# EAGLE design retainer (EAGLE 9.0.1)
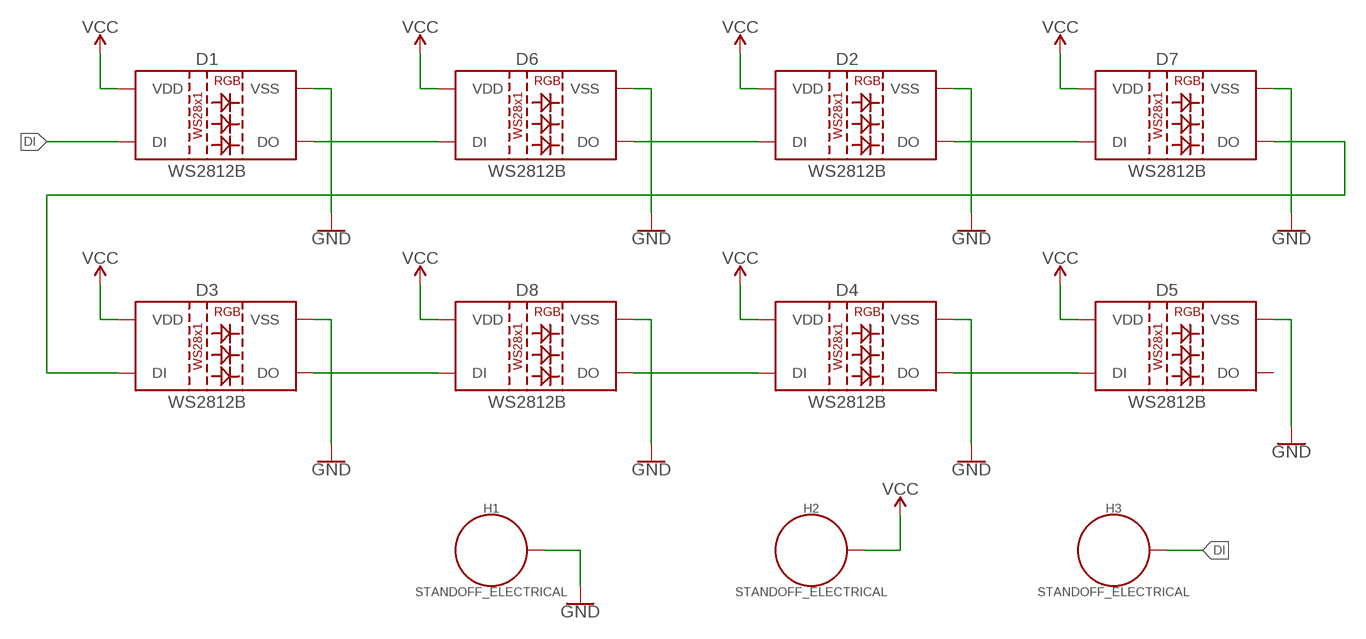
[diagram p0: schematic, sheet 1]

## Parts
D1  WS2812B  [WS2812B]
D2  WS2812B  [WS2812B]
D3  WS2812B  [WS2812B]
D4  WS2812B  [WS2812B]
D5  WS2812B  [WS2812B]
D6  WS2812B  [WS2812B]
D7  WS2812B  [WS2812B]
D8  WS2812B  [WS2812B]
H1  STANDOFF_ELECTRICAL  [STANDOFF-ELECTRICAL]
H2  STANDOFF_ELECTRICAL  [STANDOFF-ELECTRICAL]
H3  STANDOFF_ELECTRICAL  [STANDOFF-ELECTRICAL]

## Nets
DI: D1.4(DI) H3.P1
GND: D1.3(VSS) D2.3(VSS) D3.3(VSS) D4.3(VSS) D5.3(VSS) D6.3(VSS) D7.3(VSS) D8.3(VSS) H1.P1
N$3: D1.2(DO) D6.4(DI)
N$4: D2.4(DI) D6.2(DO)
N$5: D2.2(DO) D7.4(DI)
N$6: D3.4(DI) D7.2(DO)
N$7: D3.2(DO) D8.4(DI)
N$8: D4.4(DI) D8.2(DO)
N$9: D4.2(DO) D5.4(DI)
VCC: D1.1(VDD) D2.1(VDD) D3.1(VDD) D4.1(VDD) D5.1(VDD) D6.1(VDD) D7.1(VDD) D8.1(VDD) H2.P1
Unconnected: D5.2(DO)

## Library data of the parts
D1-D8 = SparkFun-LED:WS2812B: WS2812B SMD addressable RGB LED 5x5mm SMD LED with built-in controller IC. Color: Red/Green/Blue mC Rating: RGB: 390, 660, 180 mcd Forward Voltage: RGB: 2.0, 3.0, 3.0 V Packages:WS2812B SparkFun Products: Blynk Board - ESP8266 <https://www.sparkfun.com/products/13794>; PROD_ID: DIO-12503
H1-H3 = SparkFun-Hardware:STANDOFF_ELECTRICAL: Stand Off Drill holes with an electrical connection. For example, use these to ground your board to a chassis. Example SparkFun Products Screw - Phillips Head (1/4", 4-40, 10 pack) <https://www.sparkfun.com/products/10453> (PRT-10453) Screw - Phillips Head (1/2", 4-40, 10 pack) <https://www.sparkfun.com/products/10452> (PRT-10452) Screw - Phillips Head (3/4", 4-40, 10 pack) <https://www.sparkfun.com/products/10451> (PRT-10451) Screw - Phillips Head (1", 4-40, 10 pack) <https://www.sparkfun.com/products/10450> (PRT-10450)

## Board
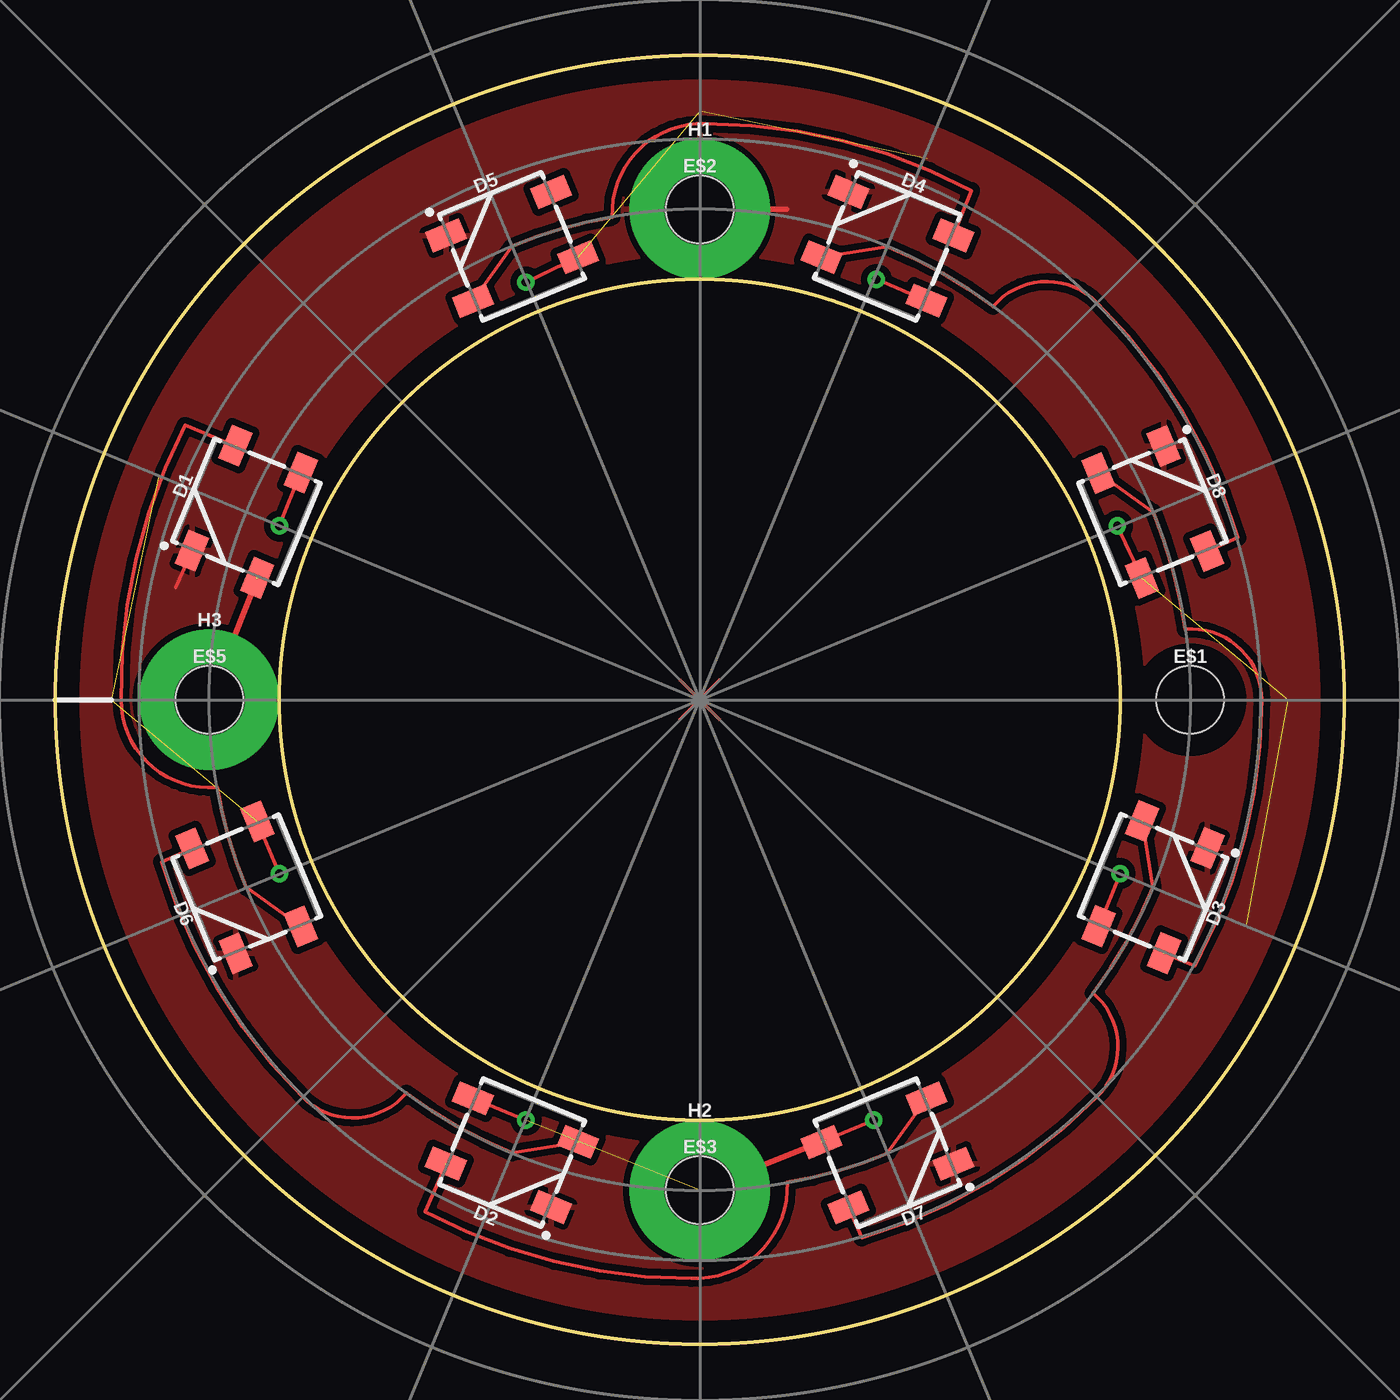
[diagram p1: board, top side]
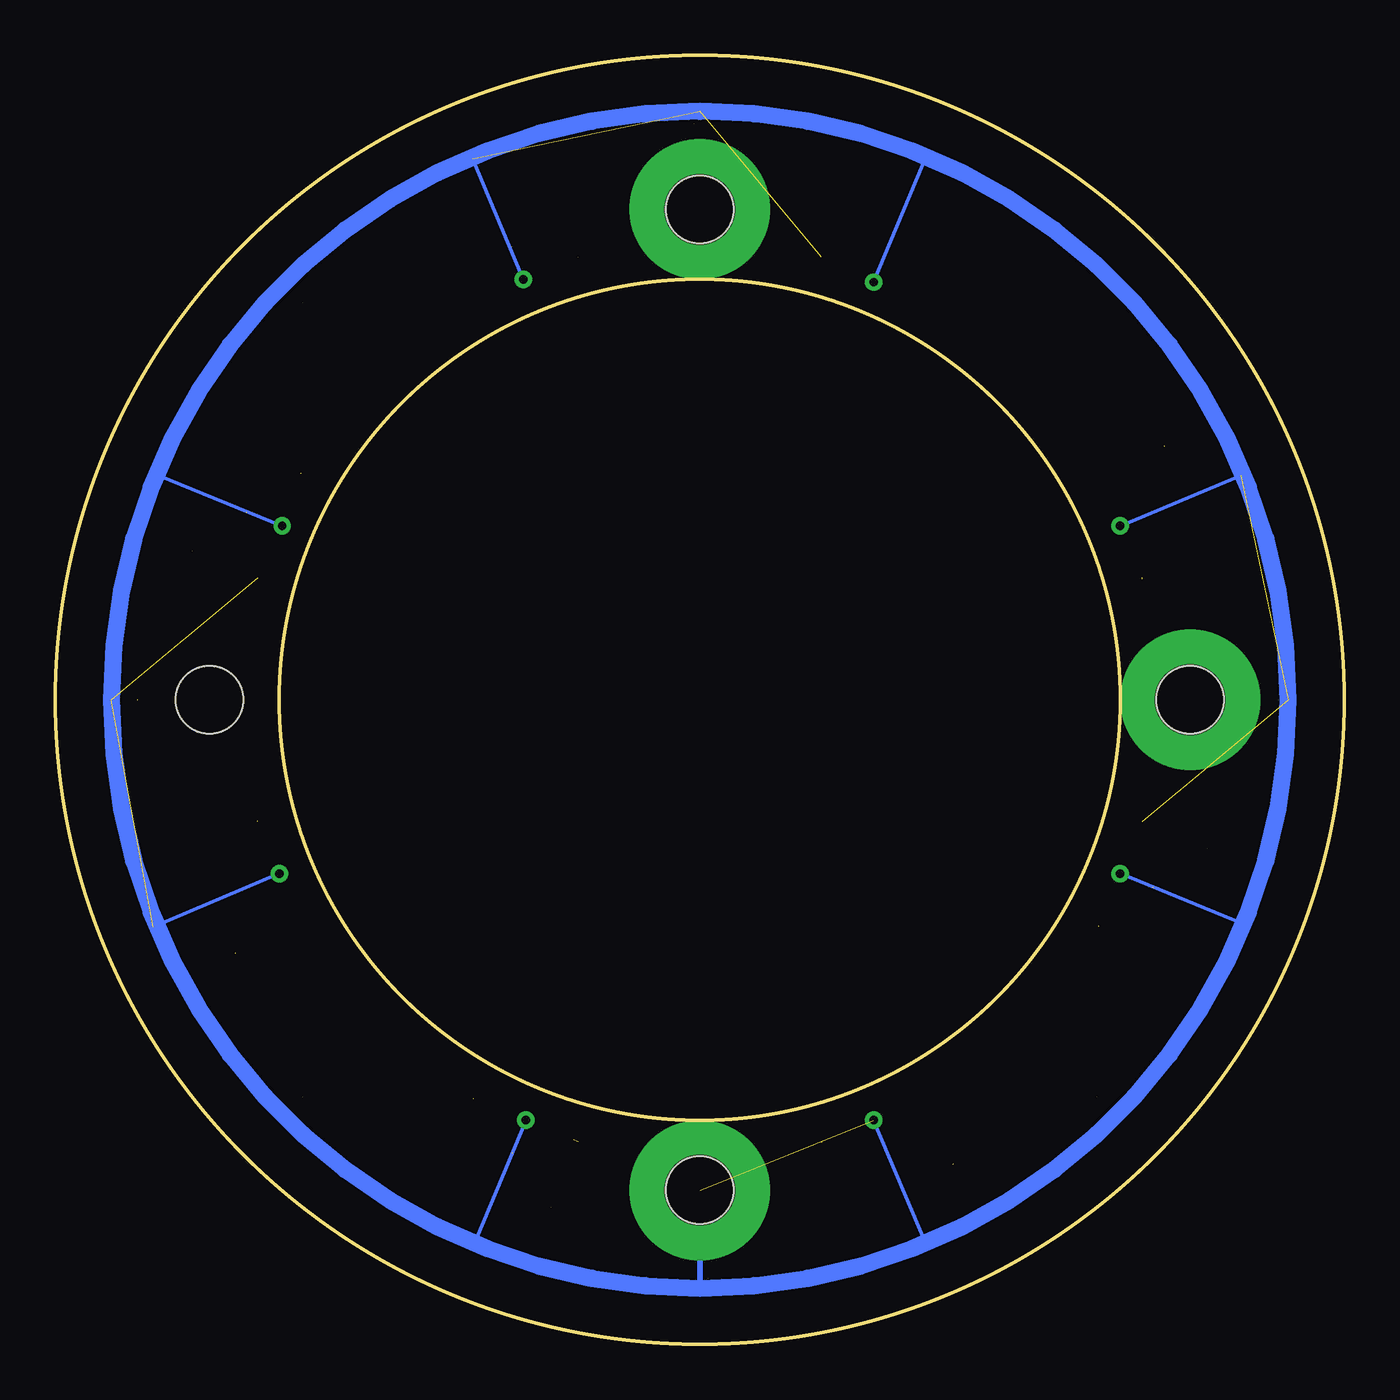
[diagram p2: board, bottom side, seen from below]

Size 58.42 x 58.42 mm. Coordinates in mm from the lower left corner, seen from the top.
Outline: circle at 29.21,29.21 radius 19.05
Outline: circle at 29.21,29.21 radius 29.21
Copper layers (1*16): Top 0.035mm / dielectric 1.5mm / Bottom 0.035mm
Design rules "default": minimum track width 10mil, minimum drill 0.6mm, track to track 8mil, track to pad 8mil, pad to pad 8mil, via to via 8mil, smd to smd 8mil, copper to edge 40mil, drill to drill 8mil, minimum pad ring 10mil, minimum via ring 8mil, stop-mask expansion 4mil, vias tented up to drill 0mil, thermal gap 10mil
tRestrict: area 10.2,10.2 to 48.3,48.3

### Footprints (pad centres in the part's own frame; a part is rotated, then mirrored left to right if it is on the bottom)
WS2812B = smd 1.651 x 1: 1 2.577,-1.6; 2 2.577,1.6; 3 -2.577,1.6; 4 -2.577,-1.6
STAND-OFF-TIGHT = hole 3.048: 0,0
STANDOFF-ELECTRICAL = drill 3.2 pad 6.35: P1 0,0

### Placement (x,y rotation side)
D1  8.66,37.73 67.5 top
D2  20.7,8.68 157.5 top
D3  49.75,20.72 247.5 top
D4  37.72,49.76 337.5 top
D5  20.7,49.76 22.5 top
D6  8.67,20.7 112.5 top
D7  37.72,8.67 202.5 top
D8  49.74,37.72 292.5 top
E$1  [STAND-OFF-TIGHT]  51.44,29.21 0 top
E$2  [STAND-OFF-TIGHT]  29.21,51.44 0 top
E$3  [STAND-OFF-TIGHT]  29.21,6.98 0 top
E$5  [STAND-OFF-TIGHT]  6.98,29.21 0 top
H1  29.21,51.44 0 top
H2  29.21,6.98 0 top
H3  6.98,29.21 0 top

### Tracks (layer width: path | path; a pad name or v marks a point on that pad's centre or on a via)
DI  (1 unrouted)
  Top 0.254: H3.P1 9.14,34.67
GND
  Top 0.152: D1.3 5.46,34.29
  Top 0.254: H1.P1 33.15,51.44
  pour Top (isolate 0.305): 29.21,58.42 arc-90 58.42,29.21 arc-90 29.21,0 arc-90 0,29.21 arc-90
N$3  (4 unrouted)
  Top 0.152: 11.13,18.93 8.67,20.7 | 8.67,20.71 arc-14 7.33,25.25 7.33,25.24 arc-95 2.98,29.21 arc-28 5.88,41.65 8.17,40.71
N$4  (4 unrouted)
  Top 0.152: 23.69,9.16 20.7,8.67 | 20.7,8.67 arc-14 15.91,11.39 15.92,11.39 arc-95 11.21,11.21 | 11.2,11.2 arc-28 4.82,21.87 D6.2
N$5  (4 unrouted)
  Top 0.152: 39.49,11.13 37.72,8.67 | 37.71,8.67 arc-14 33.17,7.33 33.18,7.33 arc-95 28.83,2.98 arc-28 16.77,6.01 17.71,8.17
N$6  (4 unrouted)
  Top 0.152: 49.26,23.69 49.75,20.7 | 49.75,20.7 arc-14 47.03,15.91 47.03,15.92 arc-95 47.22,11.21 | 47.22,11.2 arc-28 36.55,4.82 D7.2
N$7  (4 unrouted)
  Top 0.152: 47.29,39.49 49.75,37.72 | 49.75,37.71 arc-14 51.22,32.4 51.21,32.41 arc-95 54.67,29.21 arc-28 51.65,17.15 50.25,17.71
N$8  (4 unrouted)
  Top 0.152: D4.4 37.72,49.75 | 37.72,49.75 arc-14 42.51,47.03 42.5,47.03 arc-95 47.22,47.22 | 47.22,47.22 arc-28 53.6,36.55 52.22,35.96
N$9  (1 unrouted)
  Top 0.152: D5.4 20.71,49.75 arc-14 25.25,51.09 25.24,51.09 arc-95 29.46,55.31 arc-28 41.52,52.28 D4.2
N$10
  Top 0.152: 30.11,28.31 28.31,30.11
N$11
  Top 0.152: 30.11,30.11 28.31,28.31
N$13
  Top 0.152: 30.11,30.11 28.31,28.31
N$17
  Top 0.152: 28.31,28.31 30.11,30.11
N$22
  Top 0.152: 28.31,28.31 30.11,30.11
VCC  (via drill 0.38)  (8 unrouted)
  Top 0.152: D6.1 v10.16,21.34 | D2.1 v21.34,10.16 | D7.1 v37.08,10.16 | D3.1 v48.26,21.34 | D8.1 v48.13,37.08 | D4.1 v37.21,48.26 | D5.1 v21.34,48.13 | D1.1 v10.16,37.08
  Top 0.254: H2.P1 34.92,9.27
  Bottom 0.152: v10.16,21.34 4.57,19.05 | v21.34,10.16 18.92,4.45 | v37.08,10.16 39.37,4.7 | v48.26,21.34 53.98,18.92 | v48.13,37.08 53.72,39.37 | v37.21,48.26 39.5,53.72 | v21.34,48.13 19.05,53.59 | v10.16,37.08 4.7,39.37
  Bottom 0.254: H2.P1 29.21,2.54
  Bottom 0.762: 29.21,55.88 arc-90 55.88,29.21 arc-90 29.21,2.54 arc-90 2.54,29.21 arc-90 29.21,55.88